# Altium project stm32f1c8t6_scara.PrjPcb
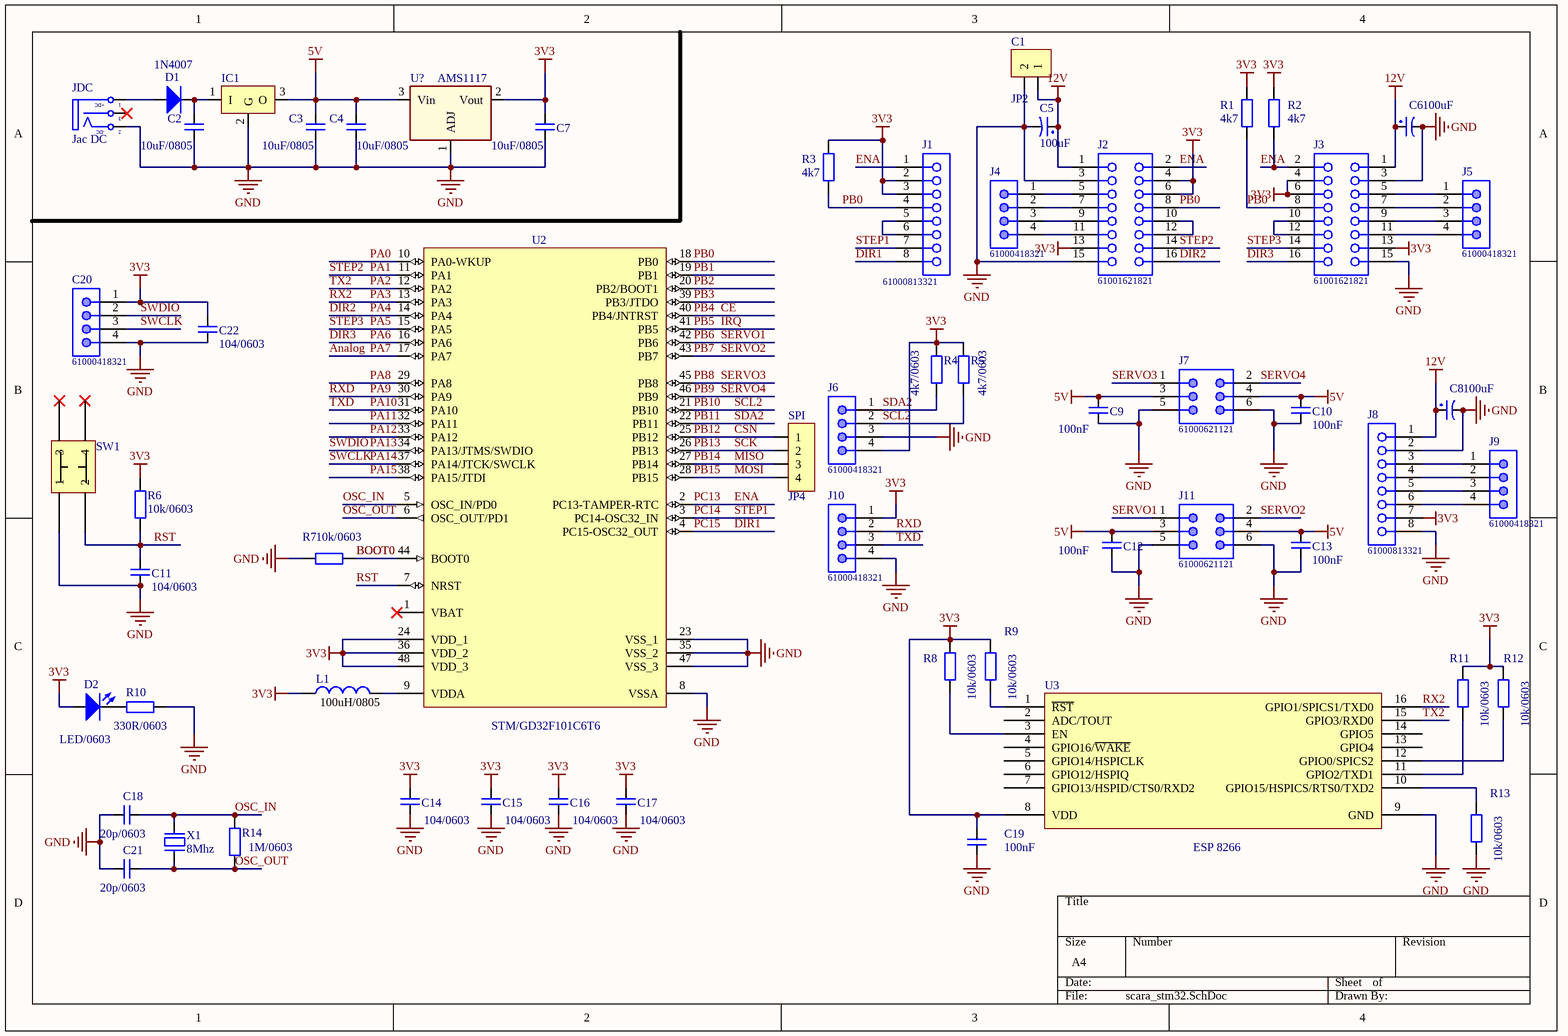
[diagram p0: scara_stm32.SchDoc]
1 sheet, 58 parts. Net scope: global (net labels, ports and power ports of the same name join across sheets).
Board file: scara_stm32.PcbDoc

## Sheet scara_stm32.SchDoc
size A4

### Parts
C1  JP2  [JP2-D1T]
C2  10uF/0805  [SM-0805]
C3  10uF/0805  [SM-0805]
C4  10uF/0805  [SM-0805]
C5  100uF  [CAP SMD ALUMINUM D]
C6  100uF  [CAP SMD ALUMINUM D]
C7  10uF/0805  [SM-0805]
C8  100uF  [CAP SMD ALUMINUM D]
C9  100nF  [SM-0603]
C10  100nF  [SM-0603]
C11  104/0603  [SM-0603]
C12  100nF  [SM-0603]
C13  100nF  [SM-0603]
C14  104/0603  [SM-0603]
C15  104/0603  [SM-0603]
C16  104/0603  [SM-0603]
C17  104/0603  [SM-0603]
C18  20p/0603  [SM-0603]
C19  100nF  [SM-0603]
C20  61000418321  [61000418321]
C21  20p/0603  [SM-0603]
C22  104/0603  [SM-0603]
D1  1N4007  [DO-214AC]
D2  LED/0603  [LED SMD 0805 RED]
IC1  LM78xx  [TO252-123]  (value not drawn)
J1  61000813321  [61000813321]
J2  61001621821  [61001621821]
J3  61001621821  [61001621821]
J4  61000418321  [61000418321]
J5  61000418321  [61000418321]
J6  61000418321  [61000418321]
J7  61000621121  [61000621121]
J8  61000813321  [61000813321]
J9  61000418321  [61000418321]
J10  61000418321  [61000418321]
J11  61000621121  [61000621121]
JDC  Jac DC  [DC0]
L1  100uH/0805  [L2012-0805]
R1  4k7  [RESISTOR SMD 0603]
R2  4k7  [RESISTOR SMD 0603]
R3  4k7  [RESISTOR SMD 0603]
R4  4k7/0603  [RESISTOR SMD 0603]
R5  4k7/0603  [RESISTOR SMD 0603]
R6  10k/0603  [RESISTOR SMD 0603]
R7  10k/0603  [RESISTOR SMD 0603]
R8  10k/0603  [RESISTOR SMD 0603]
R9  10k/0603  [RESISTOR SMD 0603]
R10  330R/0603  [RESISTOR SMD 0603]
R11  10k/0603  [RESISTOR SMD 0603]
R12  10k/0603  [RESISTOR SMD 0603]
R13  10k/0603  [RESISTOR SMD 0603]
R14  1M/0603  [RESISTOR SMD 0603]
SPI  JP4  [JP4-C1T]
SW1  SW4-3.5SMD  [SW3.54.7SMD]  (value not drawn)
U2  STM/GD32F101C6T6  [TQFP48]
U3  ESP 8266  [ESP12]
U?  AMS1117
X1  8Mhz  [XT2]

### Nets
3V3: C7.2 C14.2 C15.2 C16.2 C17.2 C19.2 C20.1 C22.2 D2.1 J1.2 J1.3 J2.4 J2.6 J2.13 J3.4 J3.6 J3.13 J6.4 J8.7 J10.1 L1.1 R1.1 R2.1 R3.1 R4.2 R5.2 R6.2 R8.2 R9.2 R11.2 R12.2 U2.24(VDD_1) U2.36(VDD_2) U2.48(VDD_3) U3.8(VDD) U?.2(Vout)
5V: C3.2 C4.2 C9.1 C10.1 C12.1 C13.1 IC1.3(O) J7.3 J7.4 J11.3 J11.4 U?.3(Vin)
12V: C1.1 C5.1 C6.1 C8.1 J2.1 J3.1 J8.1
GND: C1.2 C2.1 C3.1 C4.1 C5.2 C6.2 C7.1 C8.2 C9.2 C10.2 C11.2 C12.2 C13.2 C14.1 C15.1 C16.1 C17.1 C18.1 C19.1 C20.4 C21.1 C22.1 IC1.2(G) J2.3 J2.15 J3.3 J3.15 J6.3 J7.5 J7.6 J8.2 J8.8 J10.4 J11.5 J11.6 JDC.2(TN) R7.2 R10.2 R13.1 SW1.0(1) U2.8(VSSA) U2.23(VSS_1) U2.35(VSS_2) U2.47(VSS_3) U3.9(GND) U?.1(ADJ)
Analog: U2.17(PA7)  [also labelled PA7]
BOOT0: R7.1 U2.44(BOOT0)
CE: U2.40(PB4/JNTRST)  [also labelled PB4]
CSN: SPI.1 U2.25(PB12)  [also labelled PB12]
DIR1: J1.8 U2.4(PC15-OSC32_OUT)  [also labelled PC15]
DIR2: J2.16 U2.14(PA4)  [also labelled PA4]
DIR3: J3.16 U2.16(PA6)  [also labelled PA6]
ENA: J1.1 J2.2 J3.2 R2.2 U2.2(PC13-TAMPER-RTC)  [also labelled PC13]
IRQ: U2.41(PB5)  [also labelled PB5]
MISO: SPI.3 U2.27(PB14)  [also labelled PB14]
MOSI: SPI.4 U2.28(PB15)  [also labelled PB15]
OSC_IN: C18.2 R14.2 U2.5(OSC_IN/PD0) X1.2
OSC_OUT: C21.2 R14.1 U2.6(OSC_OUT/PD1) X1.1
PA0: U2.10(PA0-WKUP)
PA1: J2.14 U2.11(PA1)  [also labelled STEP2]
PA2: U2.12(PA2) U3.15(GPIO3/RXD0)  [also labelled TX2]
PA3: U2.13(PA3) U3.16(GPIO1/SPICS1/TXD0)  [also labelled RX2]
PA5: J3.14 U2.15(PA5)  [also labelled STEP3]
PA8: U2.29(PA8)
PA9: J10.2 U2.30(PA9)  [also labelled RXD]
PA10: J10.3 U2.31(PA10)  [also labelled TXD]
PA11: U2.32(PA11)
PA12: U2.33(PA12)
PA13: C20.2 U2.34(PA13/JTMS/SWDIO)  [also labelled SWDIO]
PA14: C20.3 U2.37(PA14/JTCK/SWCLK)  [also labelled SWCLK]
PA15: U2.38(PA15/JTDI)
PB0: J1.4 J2.8 J3.8 R1.2 R3.2 U2.18(PB0)
PB1: U2.19(PB1)
PB2: U2.20(PB2/BOOT1)
PB3: U2.39(PB3/JTDO)
PB6: J11.1 U2.42(PB6)  [also labelled SERVO1]
PB7: J11.2 U2.43(PB7)  [also labelled SERVO2]
PB8: J7.1 U2.45(PB8)  [also labelled SERVO3]
PB9: J7.2 U2.46(PB9)  [also labelled SERVO4]
PB10: J6.2 R5.1 U2.21(PB10)  [also labelled SCL2]
PB11: J6.1 R4.1 U2.22(PB11)  [also labelled SDA2]
PB13: SPI.2 U2.26(PB13)  [also labelled SCK]
PC14: J1.7 U2.3(PC14-OSC32_IN)  [also labelled STEP1]
RST: C11.1 R6.1 SW1.1(2) U2.7(NRST)
NetC2_2: C2.2 D1.2 IC1.1(I)
NetD1_1: D1.1 JDC.1(T)
NetD2_2: D2.2 R10.1
NetJ1_5: J1.5 J1.6
NetJ2_5: J2.5 J4.1
NetJ2_7: J2.7 J4.2
NetJ2_9: J2.9 J4.3
NetJ2_10: J2.10 J2.12
NetJ2_11: J2.11 J4.4
NetJ3_5: J3.5 J5.1
NetJ3_7: J3.7 J5.2
NetJ3_9: J3.9 J5.3
NetJ3_10: J3.10 J3.12
NetJ3_11: J3.11 J5.4
NetJ8_3: J8.3 J9.1
NetJ8_4: J8.4 J9.2
NetJ8_5: J8.5 J9.3
NetJ8_6: J8.6 J9.4
NetL1_2: L1.2 U2.9(VDDA)
NetR8_1: R8.1 U3.3(EN)
NetR9_1: R9.1 U3.1(~{RST})
NetR11_1: R11.1 U3.11(GPIO2/TXD1)
NetR12_1: R12.1 U3.12(GPIO0/SPICS2)
NetR13_2: R13.2 U3.10(GPIO15/HSPICS/RTS0/TXD2)

Not connected (* = marked no-connect by the designer): JDC 3(S)*; SW1 2(4)* 3*; U2 1(VBAT)*; U3 2(ADC/TOUT) 4(GPIO16/~{WAKE}) 5(GPIO14/HSPICLK) 6(GPIO12/HSPIQ) 7(GPIO13/HSPID/CTS0/RXD2) 13(GPIO4) 14(GPIO5)

### Notes on the sheet
- (in symbol DCIN) +DC; -DC

### Library data of the parts
C1 = JP2: WR-PHD 2.54 mm Angled Socket Header; Manufacturer: W¨¹rth Elektronik eiSos GmbH; partNo: 613002143121; ComponentLink1 Description: Manufacturer; ComponentLink2 Description: Datasheet; NoPins: 02; Created Date: 29 March 2013; ComponentLink1URL: http://www.we-online.com; ComponentLink2URL: http://katalog.we-online.de/em/datasheet/6130xx143121.pdf; Created by: Karrer Zheng
C2-C4 C7 C9-C19 C21 C22 = Cap_Non-Polar
C5 C6 C8 = Cap_Polar
C20 J4-J6 J9 J10 = 61000418321: SMT Vertical Pin Header WR-PHD, Pitch 2.54 mm, Single Row, 4 pins; Pin Number: 4; Pitch: 2.54 mm; Gender: Male; Rated Current: 3 A; Working Voltage: 250 VAC; Withstanding Voltage: 500 VAC; Contact Resistance: 20 mOhm; ComponentLink1Description: Manufacturer; ComponentLink1URL: http://www.we-online.de; ComponentLink2Description: Datasheet; ComponentLink2URL: https://katalog.we-online.de/em/datasheet/6100xx18321.pdf; Part Number: 61000418321; Published Date: August 2018; Publisher: Wurth Elektronik; Operating Temperature: -40 to 125 degC; Mounting Technology: SMT; Packaging: Tube; Row Number: Single; Orientation: Vertical
D1 = Diode Standard: Part Number: LED 3 ly Single Colour; Pricing: *
D2 = LED: LED Single; Value: LED 3 ly Single Colour
IC1 = LM78xx: Positive Voltage Regulator; Note: Tab is connected to pin 3 (GND).; Published: 24-Aug-2001; LatestRevisionDate: 17-Jul-2002; LatestRevisionNote: Re-released for DXP Platform.; DatasheetVersion: Apr-1994; PackageVersion: Jul-1998; PackageReference: ISOWATT220AB; Publisher: Altium Limited; PackageDescription: TO, Thru-Hole, Vertical, Heatsink Mounted; 3 In-Line Leads; Pitch 2.54 mm; Pin sequence 1, 3, 2; ComponentLink1Description: Manufacturer Link; ComponentLink1URL: http://www.st.com/; ComponentLink2Description: Datasheet; ComponentLink2URL: http://www.st.com/stonline/products/literature/ds/2146/l78m05c.pdf
J1 J8 = 61000813321: SMT Vertical Socket Header WR-PHD, Pitch 2.54 mm, Single Row, 8 pins; Pin Number: 8; Pitch: 2.54 mm; Gender: Female; Rated Current: 3 A; Working Voltage: 250 VAC; Withstanding Voltage: 500 VAC; Contact Resistance: 20 mOhm; ComponentLink1Description: Manufacturer; ComponentLink1URL: http://www.we-online.de; ComponentLink2Description: Datasheet; ComponentLink2URL: https://katalog.we-online.de/em/datasheet/6100xx13321.pdf; Part Number: 61000813321; Published Date: August 2018; Publisher: Wurth Elektronik; Operating Temperature: -40 to 125 degC; Mounting Technology: SMT; Packaging: Tube; Row Number: Single; Orientation: Vertical
J2 J3 = 61001621821: SMT Vertical Socket Header WR-PHD, Pitch 2.54 mm, Dual Row, 16 pins; Pin Number: 16; Pitch: 2.54 mm; Gender: Female; Rated Current: 3 A; Working Voltage: 250 VAC; Withstanding Voltage: 600 VAC; Contact Resistance: 20 mOhm; ComponentLink1Description: Manufacturer; ComponentLink1URL: http://www.we-online.de; ComponentLink2Description: Datasheet; ComponentLink2URL: https://katalog.we-online.de/em/datasheet/6100xx21821.pdf; Part Number: 61001621821; Published Date: August 2018; Publisher: Wurth Elektronik; Operating Temperature: -40 to 105 degC; Mounting Technology: SMT; Packaging: Tube; Row Number: Dual; Orientation: Vertical
J7 J11 = 61000621121: SMT Vertical Pin Header WR-PHD, Pitch 2.54 mm, Dual Row, 6 pins; Pin Number: 6; Pitch: 2.54 mm; Gender: Male; Rated Current: 3 A; Working Voltage: 250 VAC; Withstanding Voltage: 500 VAC; Contact Resistance: 20 mOhm; ComponentLink1Description: Manufacturer; ComponentLink1URL: http://www.we-online.de; ComponentLink2Description: Datasheet; ComponentLink2URL: https://katalog.we-online.de/em/datasheet/6100xx21121.pdf; Part Number: 61000621121; Published Date: August 2018; Publisher: Wurth Elektronik; Operating Temperature: -40 to 125 degC; Mounting Technology: SMT; Packaging: Tube; Row Number: Dual; Orientation: Vertical
JDC = DCIN: Jac DC input; Value: Jac DC
L1 = Inductor_1: Cuon Cam L; Code_IEC: 1005; Vendor: Digikey; Published: 8-Jun-2000; LatestRevisionDate: 17-Jul-2002; LatestRevisionNote: Re-released for DXP Platform.; PackageReference: 0402-A; Publisher: Altium Limited; Code_JEITA: 0402; ComponentLink1Description: Digikey Part Link; ComponentLink2Description: Open Datasheet; ComponentLink2URL: H:\LIBRARY\LIBRARY.Datasheet\; Value: 100uH/0805
R1-R14 = Resistor
SPI = JP4: WR-PHD 2.54 mm Angled Socket Header; Manufacturer: W¨¹rth Elektronik eiSos GmbH; partNo: 613004143121; ComponentLink1 Description: Manufacturer; ComponentLink2 Description: Datasheet; NoPins: 04; Created Date: 29 March 2013; ComponentLink1URL: http://www.we-online.com; ComponentLink2URL: http://katalog.we-online.de/em/datasheet/6130xx143121.pdf; Created by: Karrer Zheng
U2 = STM32F101C6T6: STM32 ARM-based 32-bit MCU with 32 Kbytes Flash, 48-pin LQFP, Industrial Temperature; Published: 30-May-2008; DatasheetVersion: rev6, Mar-2008; PackageVersion: Mar-2008; PackageReference: LQFP48; Publisher: Altium Limited; PackageDescription: 48-Pin Low-Profile Quad Flat Pack, 7 x 7 mm Body, 0.5 mm Pitch (LQFP48); ComponentLink1Description: Manufacturer Link; ComponentLink1URL: www.st.com/stm32; ComponentLink2Description: Datasheet; ComponentLink2URL: http://www.st.com/stonline/products/literature/ds/13586.pdf
U3 = ESP_12: ESP-12 Wi-Fi Module by AI-Thinker; IC: ESP8266-EX; Vendor: Ai-thinker
U? = AMS1117: Regulator SMD Chip; Vendor: Digikey; Published: 13-April-2009; Publisher: Hoang Nguyen; ComponentLink1Description: Digikey Part Link; ComponentLink2Description: Open Datasheet; ComponentLink2URL: H:\LIBRARY\LIBRARY.Datasheet\
X1 = XT2: Crystal, 32.768 KHz, -40 to 85 degC, 3.2 x 1.5 x 0.9 mm SMD; Value: 4Mhz